# EAGLE design Stator_PCB_ver_2.1 (EAGLE 7.4.0)
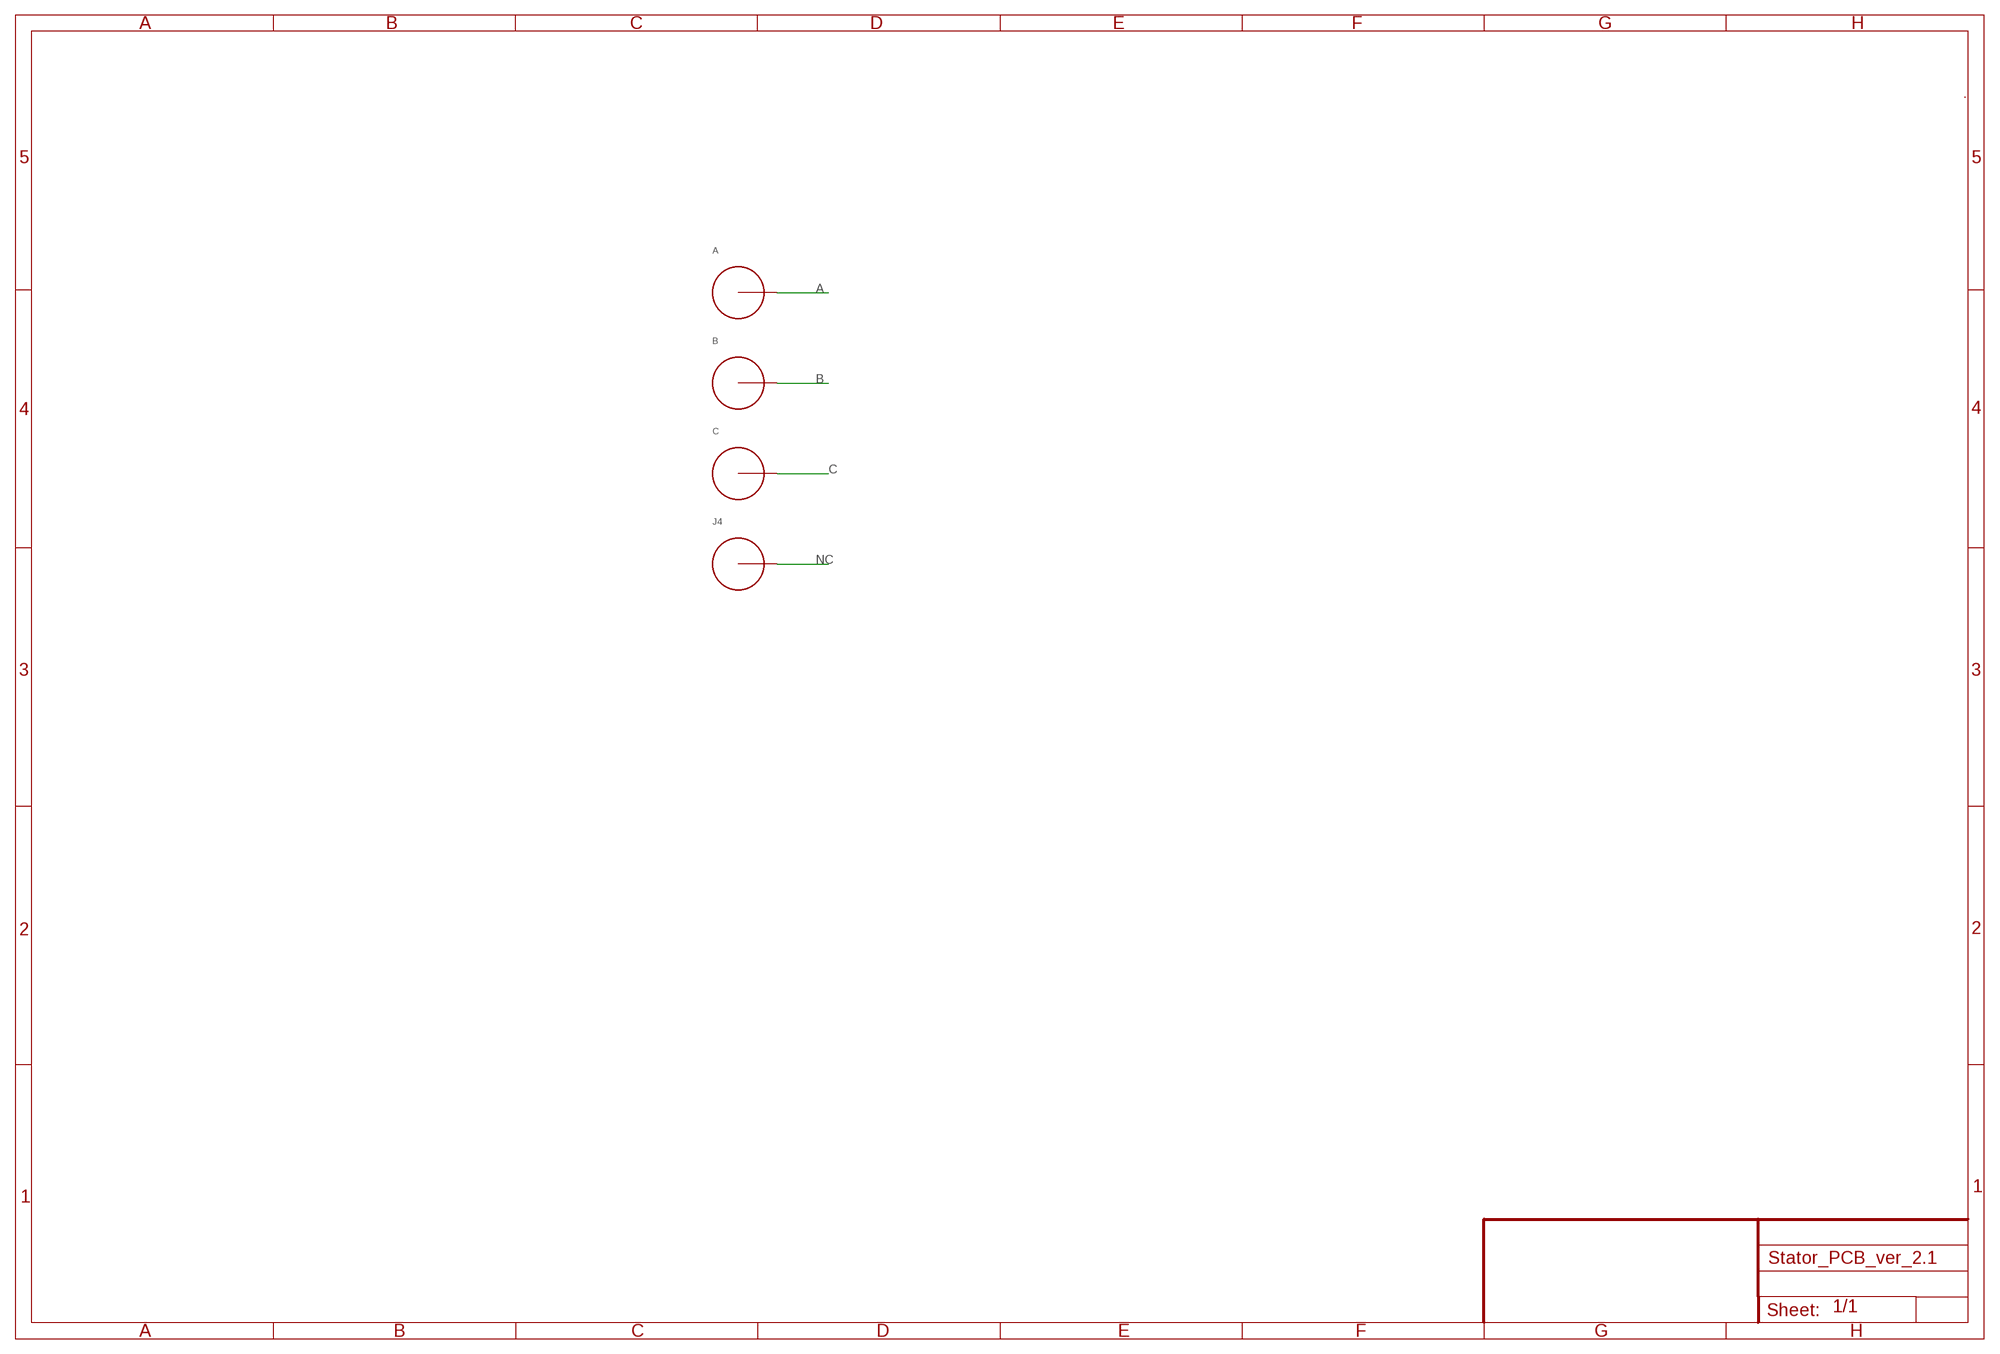
[diagram p0: schematic, sheet 1]

## Parts
A  48834883  [4883]
B  48834883  [4883]
C  48834883  [4883]
J4  48834883  [4883]

## Nets
A: A.P$1
B: B.P$1
C: C.P$1
NC: J4.P$1

## Library data of the parts
A B C J4 = KEYSTONE:4883

## Board
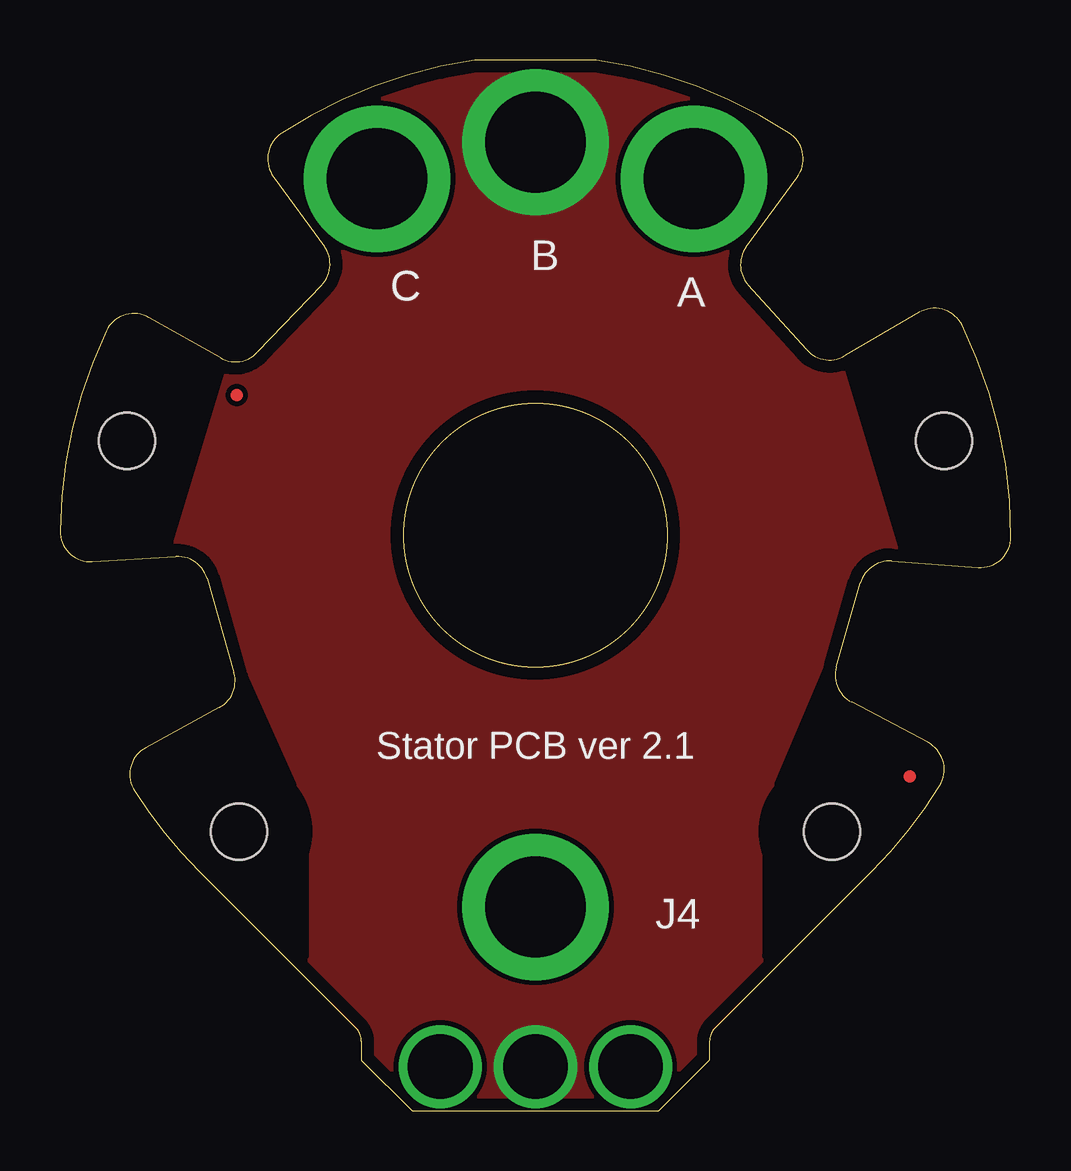
[diagram p1: board, top side]
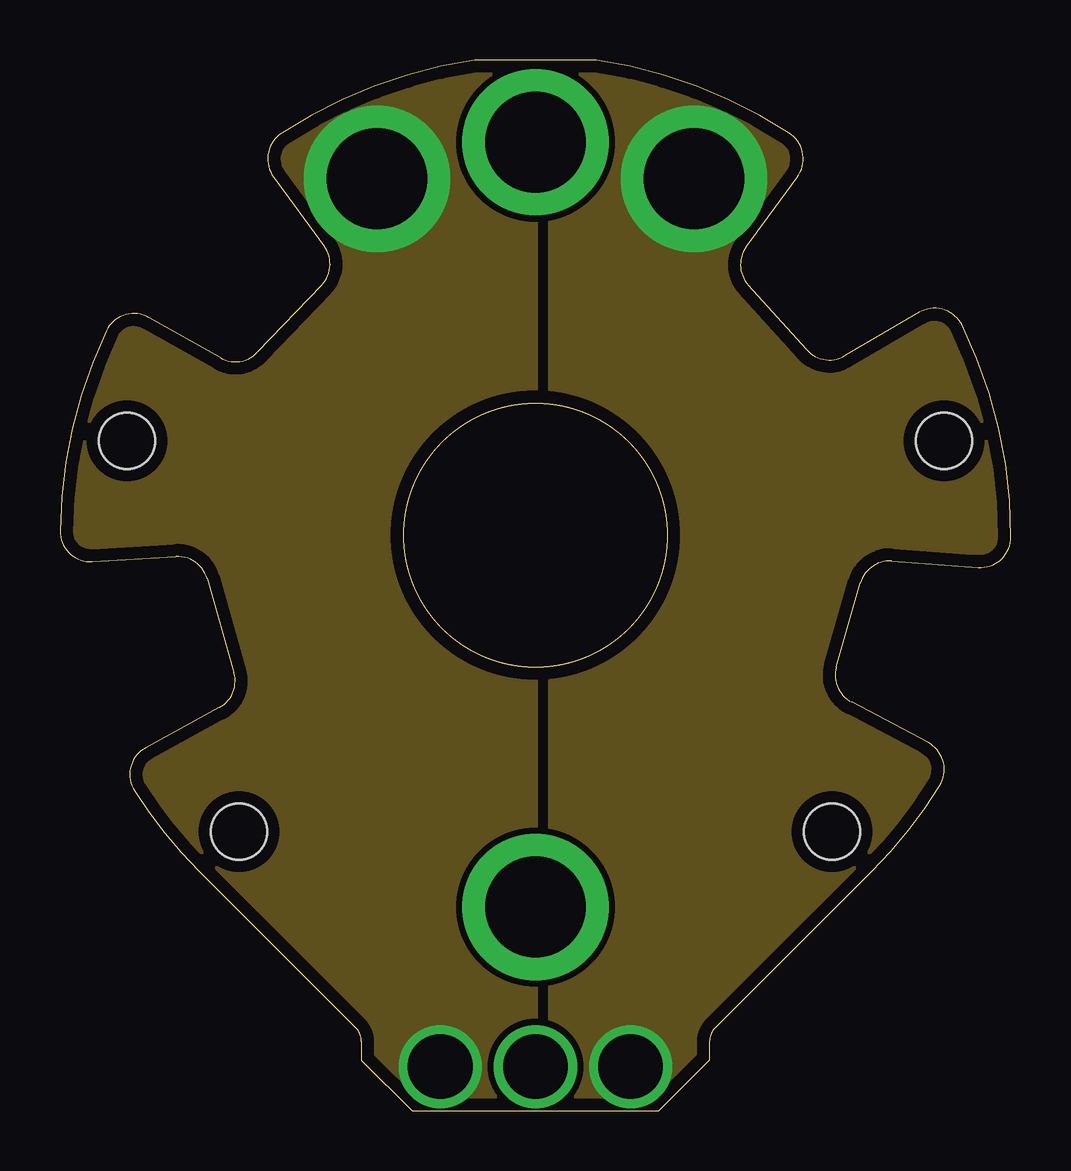
[diagram p2: board, inner layer Route2]
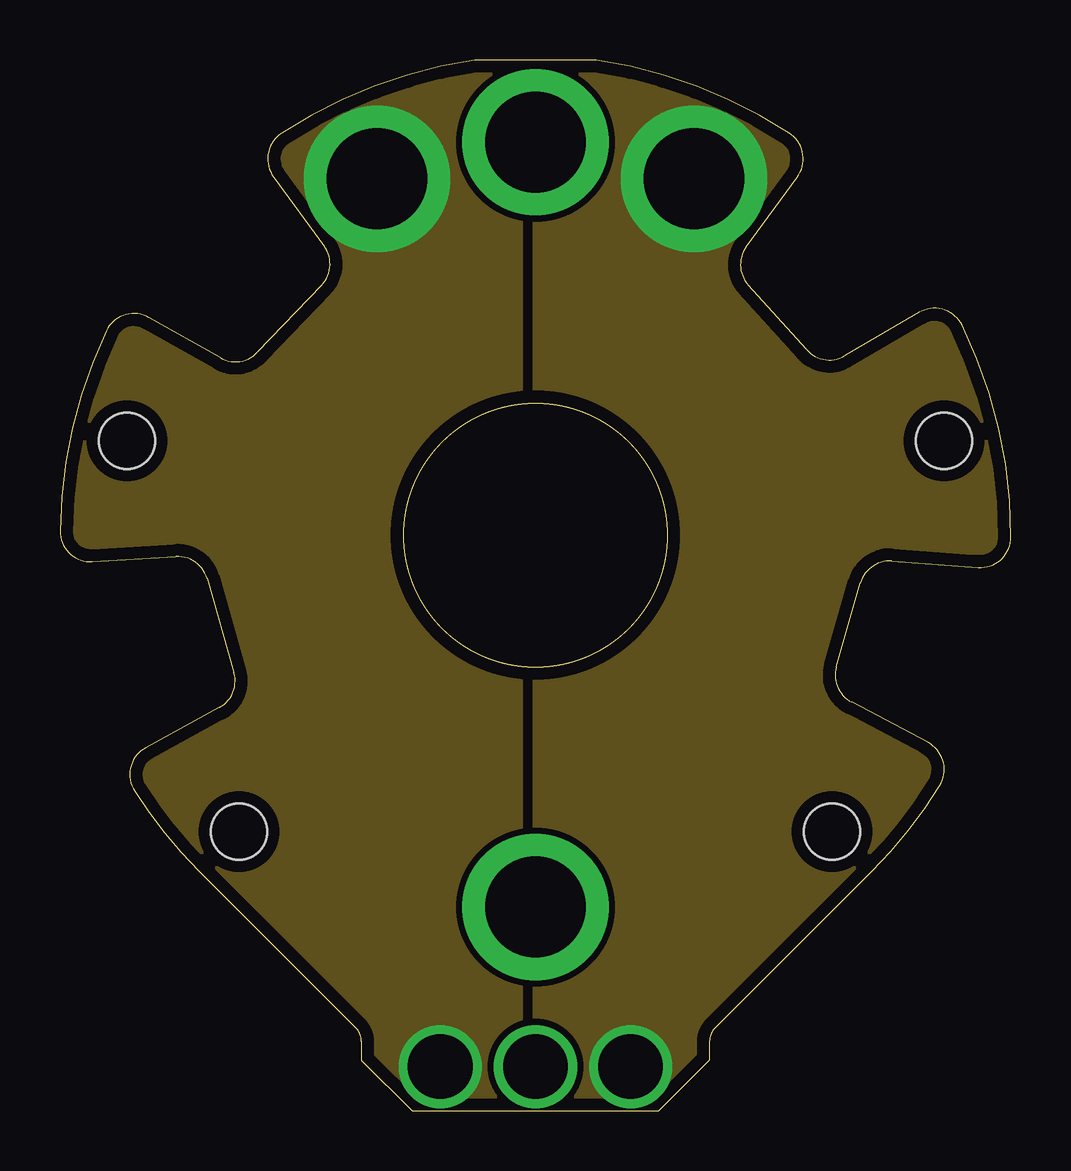
[diagram p3: board, inner layer Route3]
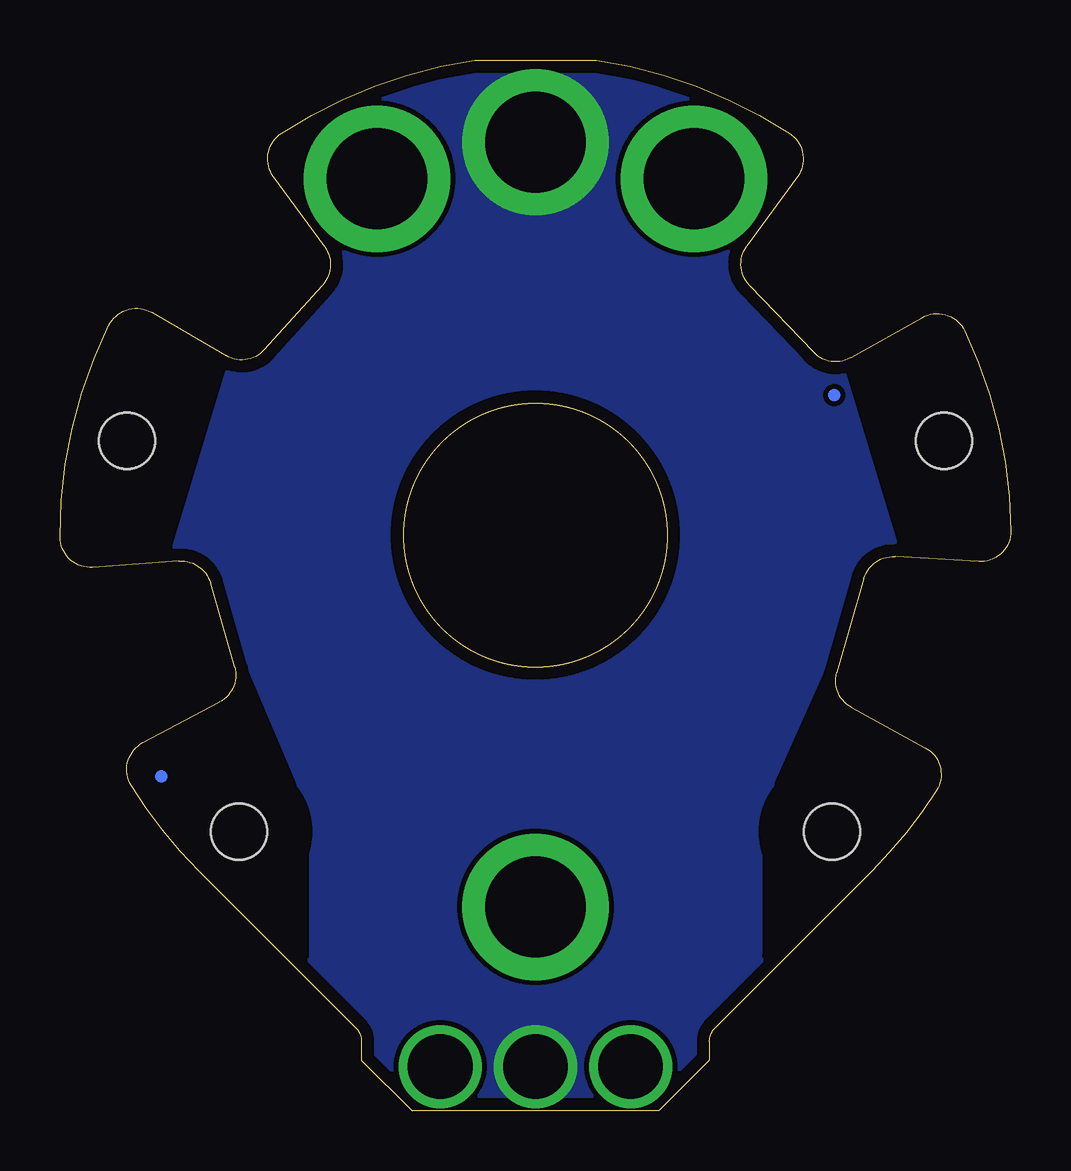
[diagram p4: board, bottom side, seen from below]

Size 39.62 x 43.81 mm. Coordinates in mm from the lower left corner, seen from the top.
Outline: 6.13,22.19 7.25,18.28 arc-77 6.64,16.81 3.57,15.14 arc94 3.11,13.34 arc12 5.8,9.99 12.33,3.46 arc-45 12.56,2.9 12.56,2.12 14.68,0 24.94,0 27.06,2.12 27.06,2.9 arc-45 27.29,3.46 33.82,9.99 arc13 36.65,13.56 arc94 36.17,15.35 32.98,17.04 arc-78 32.35,18.51 33.35,22 arc-78 34.67,22.92 38.26,22.66 arc94 39.62,23.92 arc26 37.58,32.75 arc94 35.81,33.29 32.69,31.48 arc-78 31.11,31.72 28.68,34.42 arc-78 28.6,36.02 30.72,38.93 arc94 30.38,40.76 arc24 22.35,43.81 17.27,43.81 arc24 9.25,40.76 arc94 8.9,38.93 11.01,36.05 arc-80 10.9,34.42 8.23,31.62 arc-76 6.68,31.39 3.7,33.08 arc94 1.93,32.52 arc25 0,24.18 0,24.17 arc93 1.35,22.9 4.83,23.11 arc-77 6.13,22.19
Outline: circle at 19.81,24 radius 5.5
Copper layers (1+2*3+16): Top 0.0711mm / dielectric 6mil / Route2 0.0711mm / dielectric 1mm / Route3 0.0711mm / dielectric 6mil / Bottom 0.0711mm
Design rules "default *": minimum track width 7mil, minimum drill 8mil, track to track 8mil, track to pad 8mil, pad to pad 8mil, via to via 8mil, smd to smd 8mil, copper to edge 20mil, drill to drill 8mil, minimum pad ring 5mil, minimum via ring 5mil, stop-mask expansion 2mil, vias tented up to drill 20mil, thermal gap 10mil
Holes 2.34 mm at 2.8,27.92 7.46,11.65 32.16,11.65 36.83,27.92
tRestrict: area 4.4,8.6 to 10.5,14.7; area -0.3,24.9 to 5.8,31; area 33.8,24.9 to 39.9,31; area 29.1,8.6 to 35.2,14.7; 6 lines
bRestrict: area -0.3,24.9 to 5.8,31; area 4.4,8.6 to 10.5,14.7; area 29.1,8.6 to 35.2,14.7; area 33.8,24.9 to 39.9,31; 6 lines

### Footprints (pad centres in the part's own frame; a part is rotated, then mirrored left to right if it is on the bottom)
4883 = drill 4.2 pad 6.1: P$1 0,0

### Placement (x,y rotation side)
A  26.42,38.85 0 top
B  19.81,40.38 0 top
C  13.21,38.85 0 top
J4  19.81,8.5 88 top
U$1  [20_MIL_FID]  35.4,13.95 0 top
U$2  [20_MIL_FID]  7.37,29.84 0 top

### Tracks (layer width: path | path; a pad name or v marks a point on that pad's centre or on a via)
A  (via drill 2.7 pad 2.67)
  other vias: 23.77,1.85
  pour Route2 (isolate 0.254, no thermals): 46.48,50.03 46.48,-6.48 20.45,-6.48 20.45,50.03
  pour Route3 (isolate 0.254, no thermals): 46.48,50.03 46.48,-6.48 19.81,-6.48 19.81,50.03
B  (via drill 2.7 pad 2.67)
  other vias: 19.81,1.85
  pour Bottom (no thermals): -6.5,50.31 46.91,50.31 46.91,-6.74 -6.5,-6.74
  pour Top (no thermals): -7.11,50.21 -7.11,-7.09 46.28,-7.09 46.28,50.21
C  (via drill 2.7 pad 2.67)
  other vias: 15.85,1.85
  pour Route2 (isolate 0.254, no thermals): -6.22,50.03 19.81,50.03 19.81,-6.48 -6.22,-6.48
  pour Route3 (isolate 0.254, no thermals): -6.22,50.03 19.18,50.03 19.18,-6.48 -6.22,-6.48

### Text on the board
tPlace: Stator PCB ver 2.1
Panel: ROUTED AREA